# EAGLE board regulator_plus_switch_multi_no_rdbk (EAGLE 7.2.0), part 1 of 2
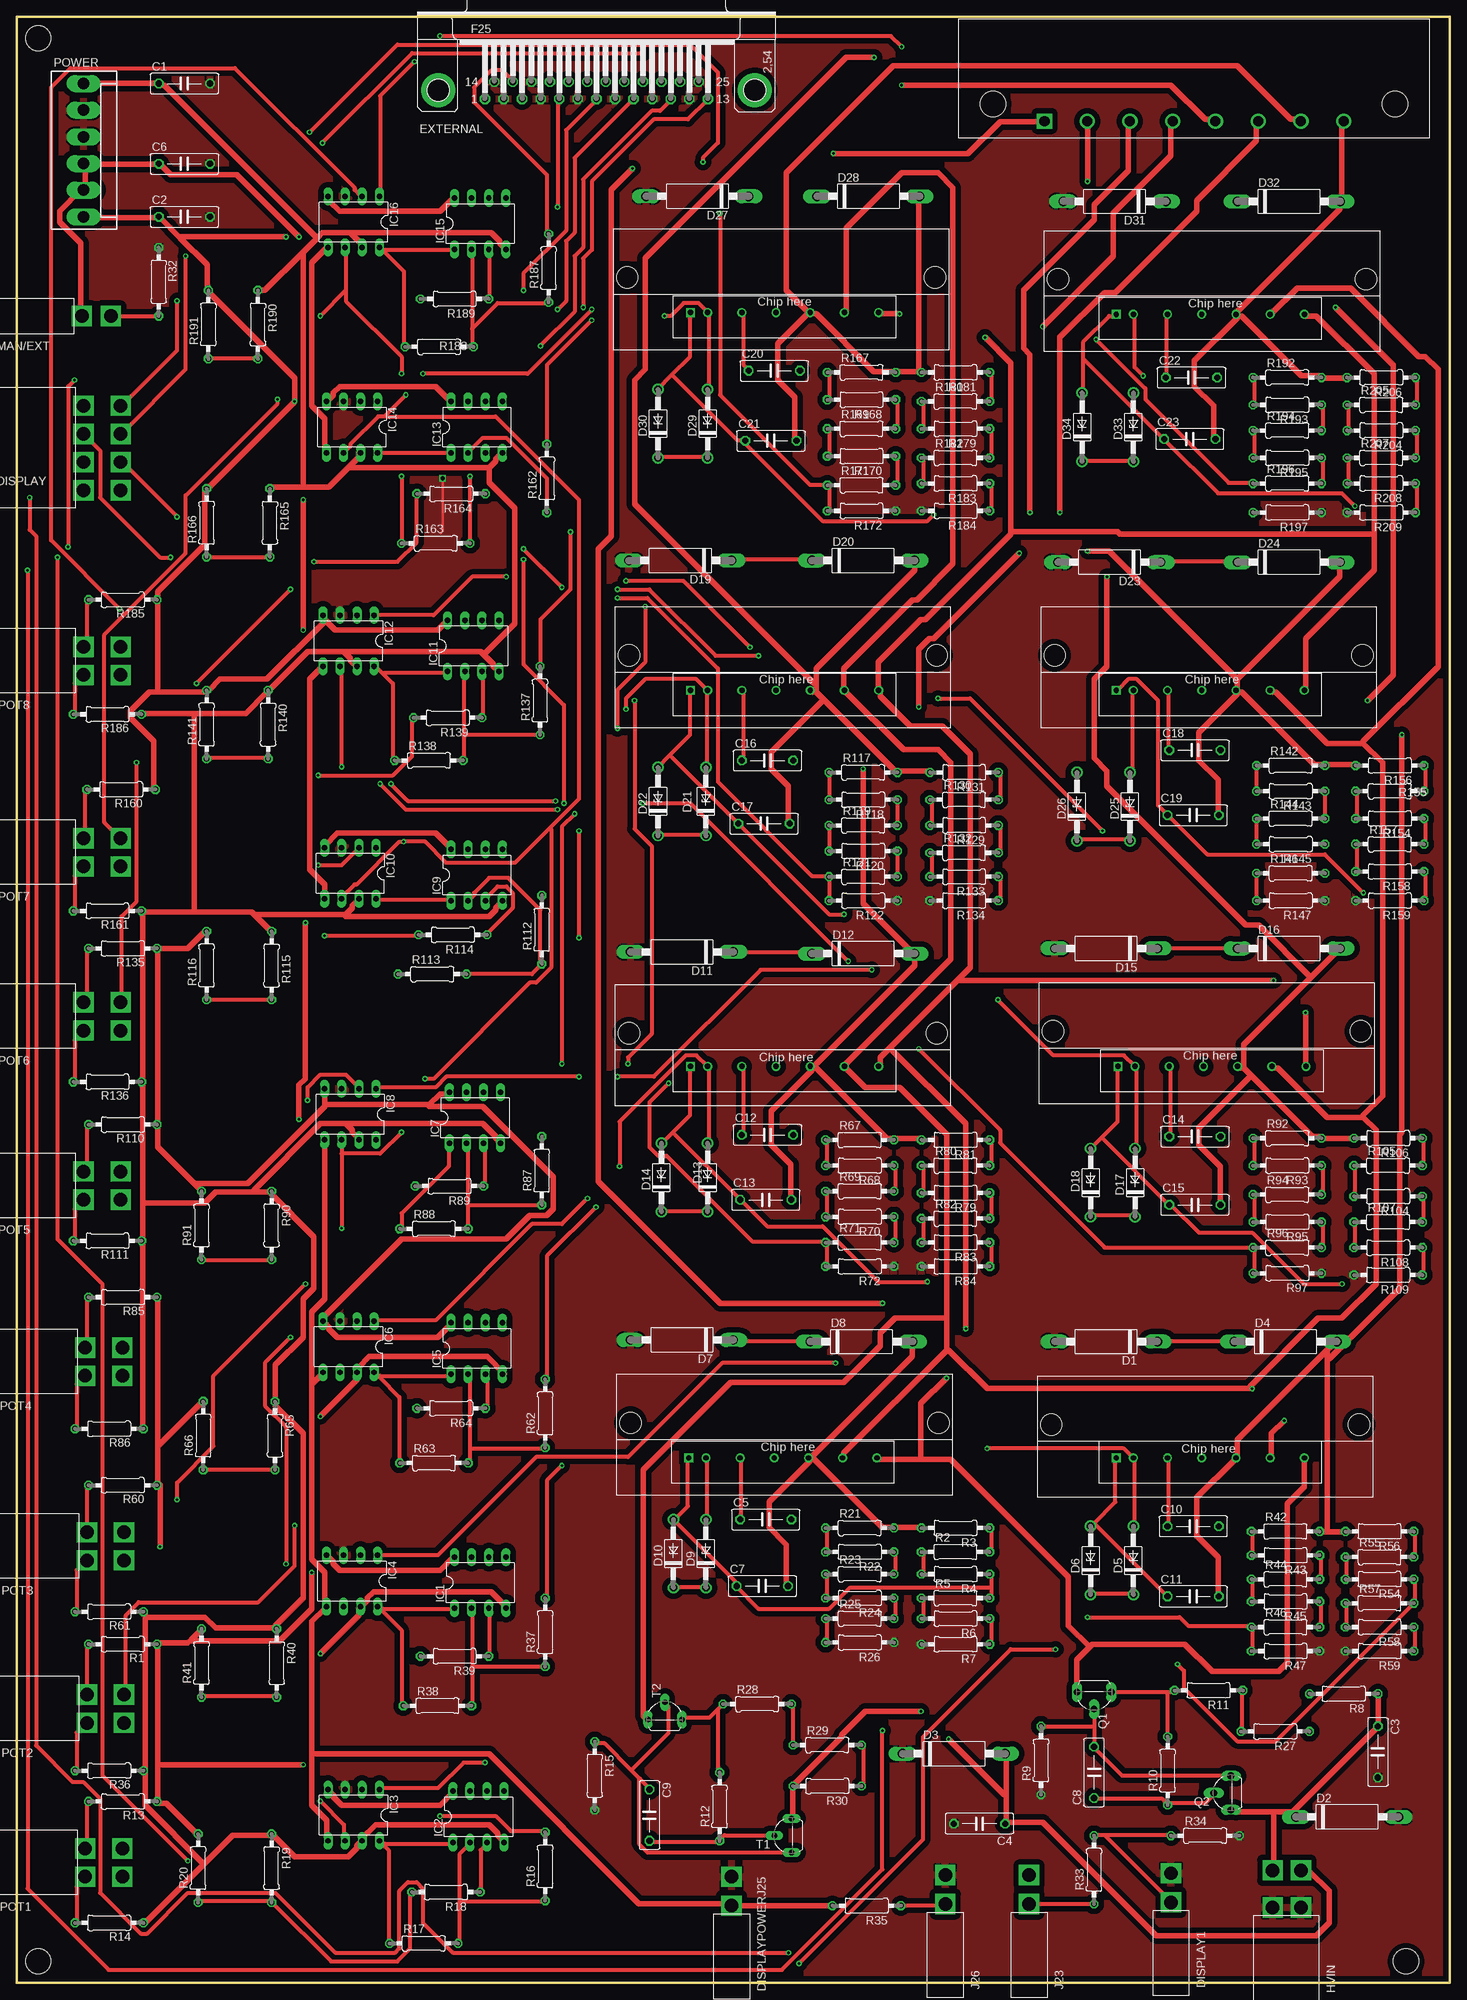
[diagram p2: board, top side]
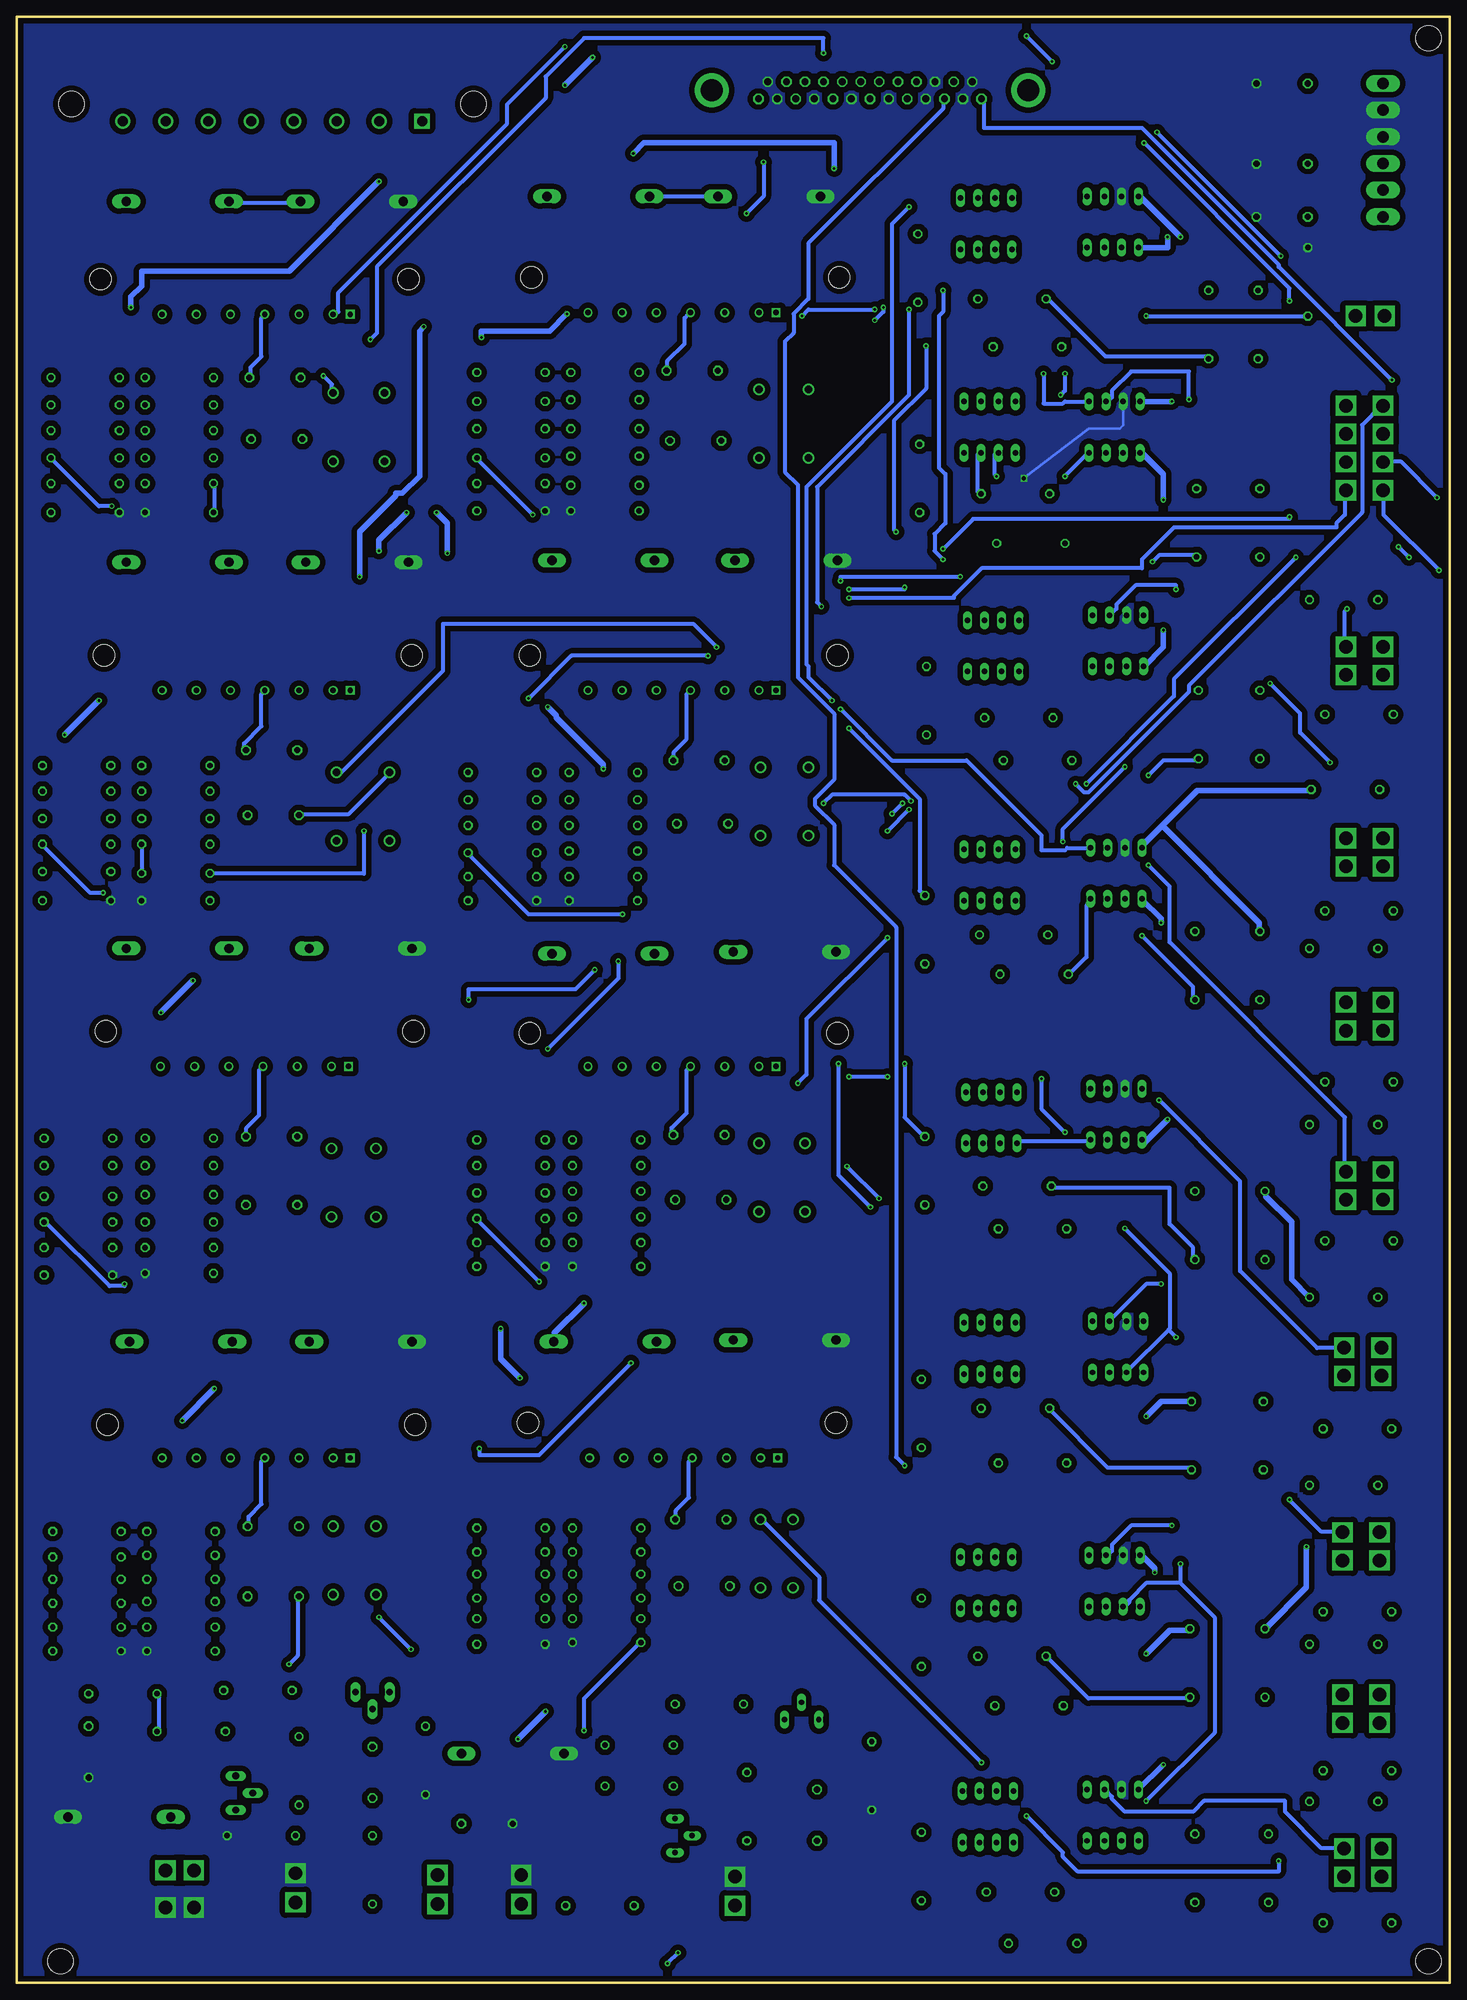
[diagram p3: board, bottom side, seen from below]

Size 212.85 x 292.1 mm. Coordinates in mm from the lower left corner, seen from the top.
Outline: 0,0 212.85,0 212.85,292.1 0,292.1 0,0
Copper layers (1*16): Top 0.035mm / dielectric 1.5mm / Bottom 0.035mm
Design rules "default *": minimum track width 24mil, minimum drill 15mil, track to track 16mil, track to pad 16mil, pad to pad 16mil, via to via 16mil, smd to smd 8mil, copper to edge 16mil, drill to drill 8mil, minimum pad ring 10mil, minimum via ring 8mil, stop-mask expansion 4mil, vias tented up to drill 0mil, thermal gap 10mil
Net classes: 0 default: width 0.406 mm, clearance 0.254 mm; 1 ground: width 0.406 mm, clearance 0.254 mm; 2 power: width 0.813 mm, clearance 0.254 mm; 3 hv: width 0.813 mm, clearance 2.032 mm
Holes 3.8 mm at 3.17,288.93 206.38,3.17 3.17,3.17

## Footprints (pad centres in the part's own frame; a part is rotated, then mirrored left to right if it is on the bottom)
C075-032X103 = drill 0.914 octagon: 1 -3.81,0; 2 3.81,0
C1702-15 = drill 1.397 long: A 7.62,0; C -7.62,0
DO41Z10 = drill 1.118: A 5.08,0; C -5.08,0
5669-8 = drill 2 square: P$1 0,0; P$2 -4.191,0; P$3 -8.382,0; P$4 -12.573,0; P$5 0,5.512; P$6 -4.191,5.512; P$7 -8.382,5.512; P$8 -12.573,5.512
5569-2 = drill 2 square: P$1 0,0; P$2 0,4.318
F25HP = drill 1.016 octagon: 1 -16.561,-1.27; 2 -13.792,-1.27; 3 -11.049,-1.27; 4 -8.28,-1.27; 5 -5.512,-1.27; 6 -2.769,-1.27; 7 0,-1.27; 8 2.769,-1.27; 9 5.512,-1.27; 10 8.28,-1.27; 11 11.049,-1.27; 12 13.792,-1.27; 13 16.561,-1.27; 14 -15.189,1.27; 15 -12.421,1.27; 16 -9.652,1.27; 17 -6.909,1.27; 18 -4.14,1.27; 19 -1.372,1.27; 20 1.372,1.27; 21 4.14,1.27; 22 6.909,1.27; 23 9.652,1.27; 24 12.421,1.27; 25 15.189,1.27 | drill 3.302 pad 5.08: G1 -23.52,0; G2 23.52,0
5669-4 = drill 2 square: P$1 0,0; P$2 -4.191,0; P$3 0,5.512; P$4 -4.191,5.512
DIL08 = drill 0.813 long: 1 -3.81,-3.81; 2 -1.27,-3.81; 3 1.27,-3.81; 4 3.81,-3.81; 5 3.81,3.81; 6 1.27,3.81; 7 -1.27,3.81; 8 -3.81,3.81
C247-050 = hole 3.2: 2.032,7.239; 47.752,7.239
640584-1 = drill 1.5 square: P$1 0,0 | drill 1.5: P$2 6.35,0; P$3 12.7,0; P$4 19.05,0; P$5 25.4,0; P$6 31.75,0; P$7 38.1,0; P$8 44.45,0 | hole 3.81: -7.62,2.54; 52.07,2.54
KK-156-6 = drill 1.7 pad 2.184 long: 1 -9.9,0; 2 -5.94,0; 3 -1.98,0; 4 1.98,0; 5 5.94,0; 6 9.9,0
TO92L = drill 1 long: 1 0,-2.54; 2 2.54,0; 3 0,2.54
0207/10 = drill 0.813 octagon: 1 -5.08,0; 2 5.08,0
TO92L' = drill 0.813 long: 1 0,-2.54; 2 2.54,0; 3 0,2.54
7SIP = drill 0.8 square: P$1 0,0 | drill 0.8: P$2 2.54,0; P$3 7.62,0; P$4 12.7,0; P$5 17.78,0; P$6 22.86,0; P$7 27.94,0

## Placement (x,y rotation side)
C1  10n  [C075-032X103]  24.89,282.19 0 top
C2  10n  [C075-032X103]  24.89,262.38 0 top
C3  10n  [C075-032X103]  202.18,34.29 270 top
C4  10n  [C075-032X103]  143,23.62 180 top
C5  10p  [C075-032X103]  111.25,68.83 0 top
C6  10n  [C075-032X103]  24.89,270.26 0 top
C7  10p  [C075-032X103]  110.74,58.93 0 top
C8  1n  [C075-032X103]  160.02,31.24 90 top
C9  1n  [C075-032X103]  93.98,24.89 270 top
C10  10p  [C075-032X103]  174.75,67.82 0 top
C11  10p  [C075-032X103]  174.75,57.4 0 top
C12  10p  [C075-032X103]  111.51,125.98 0 top
C13  10p  [C075-032X103]  111.25,116.33 0 top
C14  10p  [C075-032X103]  175.01,125.73 0 top
C15  10p  [C075-032X103]  175.01,115.57 0 top
C16  10p  [C075-032X103]  111.51,181.61 0 top
C17  10p  [C075-032X103]  111,172.21 0 top
C18  10p  [C075-032X103]  175.01,183.13 0 top
C19  10p  [C075-032X103]  174.75,173.48 0 top
C20  10p  [C075-032X103]  112.52,239.52 0 top
C21  10p  [C075-032X103]  112.01,229.11 0 top
C22  10p  [C075-032X103]  174.5,238.51 0 top
C23  10p  [C075-032X103]  174.24,229.36 0 top
D1  P6KEXXA  [C1702-15]  161.8,95.25 180 top
D2  P6KEXXA  [C1702-15]  197.61,24.64 0 top
D3  P6KEXXA  [C1702-15]  139.19,34.04 0 top
D4  P6KEXXA  [C1702-15]  188.47,95.25 0 top
D5  1n4742  [DO41Z10]  165.86,62.74 90 top
D6  1n4742  [DO41Z10]  159.51,62.74 90 top
D7  P6KEXXA  [C1702-15]  98.81,95.5 180 top
D8  P6KEXXA  [C1702-15]  125.48,95.25 0 top
D9  1n4742  [DO41Z10]  102.36,63.75 90 top
D10  1n4742  [DO41Z10]  97.54,63.75 90 top
D11  P6KEXXA  [C1702-15]  98.81,153.16 180 top
D12  P6KEXXA  [C1702-15]  125.73,152.91 0 top
D13  1n4742  [DO41Z10]  102.62,119.63 90 top
D14  1n4742  [DO41Z10]  95.76,119.63 90 top
D15  P6KEXXA  [C1702-15]  161.8,153.67 180 top
D16  P6KEXXA  [C1702-15]  188.98,153.67 0 top
D17  1n4742  [DO41Z10]  166.12,118.87 90 top
D18  1n4742  [DO41Z10]  159.51,118.87 90 top
D19  P6KEXXA  [C1702-15]  98.55,211.33 180 top
D20  P6KEXXA  [C1702-15]  125.73,211.33 0 top
D21  1n4742  [DO41Z10]  102.36,175.51 90 top
D22  1n4742  [DO41Z10]  95.25,175.51 90 top
D23  P6KEXXA  [C1702-15]  162.31,211.07 180 top
D24  P6KEXXA  [C1702-15]  188.98,211.07 0 top
D25  1n4742  [DO41Z10]  165.35,174.75 90 top
D26  1n4742  [DO41Z10]  157.48,174.75 90 top
D27  P6KEXXA  [C1702-15]  101.09,265.43 180 top
D28  P6KEXXA  [C1702-15]  126.49,265.43 0 top
D29  1n4742  [DO41Z10]  102.62,231.65 90 top
D30  1n4742  [DO41Z10]  95.25,231.65 90 top
D31  P6KEXXA  [C1702-15]  163.07,264.67 180 top
D32  P6KEXXA  [C1702-15]  188.98,264.67 0 top
D33  1n4742  [DO41Z10]  165.86,231.14 90 top
D34  1n4742  [DO41Z10]  158.24,231.14 90 top
DISPLAY  5669-8  [5669-8]  9.91,221.74 270 top
DISPLAY1  5569-2  [5569-2]  171.45,11.94 0 top
DISPLAYPOWERJ25  5569-2  [5569-2]  106.17,11.43 0 top
EXTERNAL  [F25HP]  86.11,281.18 0 top
HVIN  5569-4  [5669-4]  190.75,11.18 0 top
IC1  LT1352PA  [DIL08]  68.83,59.44 0 top
IC2  LT1352PA  [DIL08]  68.58,24.64 0 top
IC3  DG419DJN  [DIL08]  50.04,24.89 180 top
IC4  DG419DJN  [DIL08]  49.78,59.69 180 top
IC5  LT1352PA  [DIL08]  68.33,94.23 0 top
IC6  DG419DJN  [DIL08]  49.28,94.49 180 top
IC7  LT1352PA  [DIL08]  68.07,128.52 0 top
IC8  DG419DJN  [DIL08]  49.53,129.03 180 top
IC9  LT1352PA  [DIL08]  68.33,164.59 0 top
IC10  DG419DJN  [DIL08]  49.53,164.85 180 top
IC11  LT1352PA  [DIL08]  67.82,198.63 0 top
IC12  DG419DJN  [DIL08]  49.28,199.39 180 top
IC13  LT1352PA  [DIL08]  68.33,231.14 0 top
IC14  DG419DJN  [DIL08]  49.78,231.14 180 top
IC15  LT1352PA  [DIL08]  68.83,261.37 0 top
IC16  DG419DJN  [DIL08]  50.04,261.62 180 top
J23  5569-2  [5569-2]  150.37,11.68 0 top
J26  5569-2  [5569-2]  137.92,11.68 0 top
KK1  SK125/50C247  [C247-050]  138.94,90.42 180 top
KK2  SK125/50C247  [C247-050]  201.42,90.17 180 top
KK3  SK125/50C247  [C247-050]  138.68,148.34 180 top
KK4  SK125/50C247  [C247-050]  138.68,204.47 180 top
KK5  SK125/50C247  [C247-050]  201.93,204.47 180 top
KK6  SK125/50C247  [C247-050]  138.43,260.6 180 top
KK7  SK125/50C247  [C247-050]  202.44,260.35 180 top
KK8  SK125/50C247  [C247-050]  201.68,148.59 180 top
MAN/EXT  5569-2  [5569-2]  9.65,247.65 270 top
OUT  640584-1  [640584-1]  152.65,276.61 0 top
POT1  5569-4  [5669-4]  10.16,15.75 270 top
POT2  5569-4  [5669-4]  10.41,38.61 270 top
POT3  5569-4  [5669-4]  10.41,62.74 270 top
POT4  5569-4  [5669-4]  10.16,90.17 270 top
POT5  5569-4  [5669-4]  9.91,116.33 270 top
POT6  5569-4  [5669-4]  9.91,141.48 270 top
POT7  5569-4  [5669-4]  9.91,165.86 270 top
POT8  5569-4  [5669-4]  9.91,194.31 270 top
POWER  [KK-156-6]  9.91,272.29 270 top
Q1  STX616-AP  [TO92L]  160.02,43.18 270 top
Q2  STX616-AP  [TO92L]  180.34,28.19 180 top
R1  20k  [0207/10]  15.75,50.29 180 top
R2  1M  [0207/10]  139.45,64.01 0 top
R3  1M  [0207/10]  139.45,67.56 180 top
R4  1M  [0207/10]  139.45,60.71 180 top
R5  25.5k  [0207/10]  139.45,57.15 0 top
R6  25.5k  [0207/10]  139.45,54.1 180 top
R7  25.5k  [0207/10]  139.45,50.29 180 top
R8  16.9  [0207/10]  197.1,42.93 180 top
R9  4.99M  [0207/10]  152.15,33.02 90 top
R10  1k  [0207/10]  170.94,31.5 90 top
R11  16.9  [0207/10]  177.04,43.43 180 top
R12  1k  [0207/10]  104.39,26.16 90 top
R13  20k  [0207/10]  15.75,26.92 180 top
R14  20k  [0207/10]  13.72,8.89 180 top
R15  4.99M  [0207/10]  85.85,30.73 270 top
R16  10k  [0207/10]  78.49,17.27 90 top
R17  40k  [0207/10]  60.45,5.84 0 top
R18  10k  [0207/10]  63.75,13.46 180 top
R19  17k  [0207/10]  37.85,17.02 270 top
R20  13k  [0207/10]  26.92,17.02 90 top
R21  1M  [0207/10]  125.22,67.56 0 top
R22  1M  [0207/10]  125.22,64.01 180 top
R23  1M  [0207/10]  125.22,60.71 0 top
R24  1M  [0207/10]  125.22,57.15 180 top
R25  1M  [0207/10]  125.22,54.1 0 top
R26  100k  [0207/10]  125.22,50.55 180 top
R27  16.9  [0207/10]  186.94,37.34 180 top
R28  16.9  [0207/10]  109.98,41.4 0 top
R29  16.9  [0207/10]  120.4,35.31 0 top
R30  16.9  [0207/10]  120.4,29.21 180 top
R32  100k  [0207/10]  21.08,252.73 270 top
R33  90.9k  [0207/10]  160.02,16.76 90 top
R34  10k  [0207/10]  176.53,21.84 0 top
R35  294  [0207/10]  126.24,11.43 180 top
R36  20k  [0207/10]  13.72,31.5 180 top
R37  10k  [0207/10]  78.49,52.07 90 top
R38  40k  [0207/10]  62.48,41.15 0 top
R39  10k  [0207/10]  65.02,48.51 180 top
R40  17k  [0207/10]  38.61,47.5 270 top
R41  13k  [0207/10]  27.43,47.5 90 top
R42  1M  [0207/10]  188.47,67.06 0 top
R43  1M  [0207/10]  188.47,63.5 180 top
R44  1M  [0207/10]  188.47,59.94 0 top
R45  1M  [0207/10]  188.47,56.64 180 top
R46  1M  [0207/10]  188.47,52.83 0 top
R47  100k  [0207/10]  188.47,49.28 180 top
R54  1M  [0207/10]  202.44,59.94 180 top
R55  1M  [0207/10]  202.44,63.25 0 top
R56  1M  [0207/10]  202.44,67.06 180 top
R57  25.5k  [0207/10]  202.44,56.39 0 top
R58  25.5k  [0207/10]  202.44,52.83 180 top
R59  25.5k  [0207/10]  202.44,49.28 180 top
R60  20k  [0207/10]  15.75,73.91 180 top
R61  20k  [0207/10]  13.72,55.12 180 top
R62  10k  [0207/10]  78.49,84.58 90 top
R63  40k  [0207/10]  61.98,77.22 0 top
R64  10k  [0207/10]  64.52,85.34 180 top
R65  17k  [0207/10]  38.35,81.28 270 top
R66  13k  [0207/10]  27.69,81.28 90 top
R67  1M  [0207/10]  125.22,125.22 0 top
R68  1M  [0207/10]  125.22,121.41 180 top
R69  1M  [0207/10]  125.22,117.6 0 top
R70  1M  [0207/10]  125.22,113.79 180 top
R71  1M  [0207/10]  125.22,109.98 0 top
R72  100k  [0207/10]  125.22,106.43 180 top
R79  1M  [0207/10]  139.45,117.35 180 top
R80  1M  [0207/10]  139.45,121.41 0 top
R81  1M  [0207/10]  139.45,125.22 180 top
R82  25.5k  [0207/10]  139.45,113.54 0 top
R83  25.5k  [0207/10]  139.45,109.98 180 top
R84  25.5k  [0207/10]  139.45,106.43 180 top
R85  20k  [0207/10]  15.75,101.85 180 top
R86  20k  [0207/10]  13.72,82.3 180 top
R87  10k  [0207/10]  77.98,120.65 90 top
R88  40k  [0207/10]  61.98,112.01 0 top
R89  10k  [0207/10]  64.26,118.36 180 top
R90  17k  [0207/10]  37.85,112.52 270 top
R91  13k  [0207/10]  27.43,112.52 90 top
R92  1M  [0207/10]  188.72,125.48 0 top
R93  1M  [0207/10]  188.72,121.41 180 top
R94  1M  [0207/10]  188.72,117.09 0 top
R95  1M  [0207/10]  188.72,113.03 180 top
R96  1M  [0207/10]  188.72,109.22 0 top
R97  100k  [0207/10]  188.72,105.41 180 top
R104  1M  [0207/10]  203.71,116.84 180 top
R105  1M  [0207/10]  203.71,121.41 0 top
R106  1M  [0207/10]  203.71,125.48 180 top
R107  25.5k  [0207/10]  203.71,113.03 0 top
R108  25.5k  [0207/10]  203.71,109.22 180 top
R109  25.5k  [0207/10]  203.71,105.16 180 top
R110  20k  [0207/10]  15.75,127.51 180 top
R111  20k  [0207/10]  13.46,110.24 180 top
R112  10k  [0207/10]  77.98,156.46 90 top
R113  40k  [0207/10]  61.72,149.86 0 top
R114  10k  [0207/10]  64.77,155.7 180 top
R115  17k  [0207/10]  37.85,151.13 270 top
R116  13k  [0207/10]  28.19,151.13 90 top
R117  1M  [0207/10]  125.73,179.83 0 top
R118  1M  [0207/10]  125.73,175.77 180 top
R119  1M  [0207/10]  125.73,171.96 0 top
R120  1M  [0207/10]  125.73,168.15 180 top
R121  1M  [0207/10]  125.73,164.34 0 top
R122  100k  [0207/10]  125.73,160.78 180 top
R129  1M  [0207/10]  140.72,171.96 180 top
R130  1M  [0207/10]  140.72,175.77 0 top
R131  1M  [0207/10]  140.72,179.83 180 top
R132  25.5k  [0207/10]  140.72,167.89 0 top
R133  25.5k  [0207/10]  140.72,164.34 180 top
R134  25.5k  [0207/10]  140.72,160.78 180 top
R135  20k  [0207/10]  15.75,153.67 180 top
R136  20k  [0207/10]  13.46,133.86 180 top
R137  10k  [0207/10]  77.72,190.5 90 top
R138  40k  [0207/10]  61.21,181.61 0 top
R139  10k  [0207/10]  64.01,187.96 180 top
R140  17k  [0207/10]  37.34,186.94 270 top
R141  13k  [0207/10]  28.19,186.94 90 top
R142  1M  [0207/10]  189.23,180.85 0 top
R143  1M  [0207/10]  189.23,177.04 180 top
R144  1M  [0207/10]  189.23,172.97 0 top
R145  1M  [0207/10]  189.23,169.16 180 top
R146  1M  [0207/10]  189.23,164.85 0 top
R147  100k  [0207/10]  189.23,160.78 180 top
R154  1M  [0207/10]  203.96,172.97 180 top
R155  1M  [0207/10]  203.96,177.04 0 top
R156  1M  [0207/10]  203.96,180.85 180 top
R157  25.5k  [0207/10]  203.96,169.16 0 top
R158  25.5k  [0207/10]  203.96,165.1 180 top
R159  25.5k  [0207/10]  203.96,160.78 180 top
R160  20k  [0207/10]  15.49,177.29 180 top
R161  20k  [0207/10]  13.46,159.26 180 top
R162  10k  [0207/10]  78.74,223.52 90 top
R163  40k  [0207/10]  62.23,213.87 0 top
R164  10k  [0207/10]  64.52,221.23 180 top
R165  17k  [0207/10]  37.59,216.92 270 top
R166  13k  [0207/10]  28.19,216.92 90 top
R167  1M  [0207/10]  125.48,239.27 0 top
R168  1M  [0207/10]  125.48,235.2 180 top
R169  1M  [0207/10]  125.48,230.89 0 top
R170  1M  [0207/10]  125.48,226.82 180 top
R171  1M  [0207/10]  125.48,222.5 0 top
R172  100k  [0207/10]  125.48,218.69 180 top
R179  1M  [0207/10]  139.45,230.89 180 top
R180  1M  [0207/10]  139.45,234.95 0 top
R181  1M  [0207/10]  139.45,239.27 180 top
R182  25.5k  [0207/10]  139.45,226.57 0 top
R183  25.5k  [0207/10]  139.45,222.76 180 top
R184  25.5k  [0207/10]  139.45,218.69 180 top
R185  20k  [0207/10]  15.75,205.49 180 top
R186  20k  [0207/10]  13.46,188.47 180 top
R187  10k  [0207/10]  78.99,254.76 90 top
R188  40k  [0207/10]  62.74,243.08 0 top
R189  10k  [0207/10]  65.02,250.19 180 top
R190  17k  [0207/10]  35.81,246.38 270 top
R191  13k  [0207/10]  28.45,246.38 90 top
R192  1M  [0207/10]  188.72,238.51 0 top
R193  1M  [0207/10]  188.72,234.44 180 top
R194  1M  [0207/10]  188.72,230.63 0 top
R195  1M  [0207/10]  188.72,226.57 180 top
R196  1M  [0207/10]  188.72,222.76 0 top
R197  100k  [0207/10]  188.72,218.44 180 top
R204  1M  [0207/10]  202.69,230.63 180 top
R205  1M  [0207/10]  202.69,234.44 0 top
R206  1M  [0207/10]  202.69,238.51 180 top
R207  25.5k  [0207/10]  202.69,226.57 0 top
R208  25.5k  [0207/10]  202.69,222.76 180 top
R209  25.5k  [0207/10]  202.69,218.44 180 top
T1  ZTX560  [TO92L']  115.06,21.84 180 top
T2  ZTX560  [TO92L']  96.27,39.12 90 top
U$1  PA97  [7SIP]  163.32,77.98 0 top
U$2  PA97  [7SIP]  100.08,136.14 0 top
U$3  PA97  [7SIP]  163.58,136.14 0 top
U$4  PA97  [7SIP]  99.82,77.98 0 top
U$5  PA97  [7SIP]  100.08,192.02 0 top
U$6  PA97  [7SIP]  163.32,192.02 0 top
U$7  PA97  [7SIP]  100.08,248.16 0 top
U$8  PA97  [7SIP]  163.32,247.9 0 top